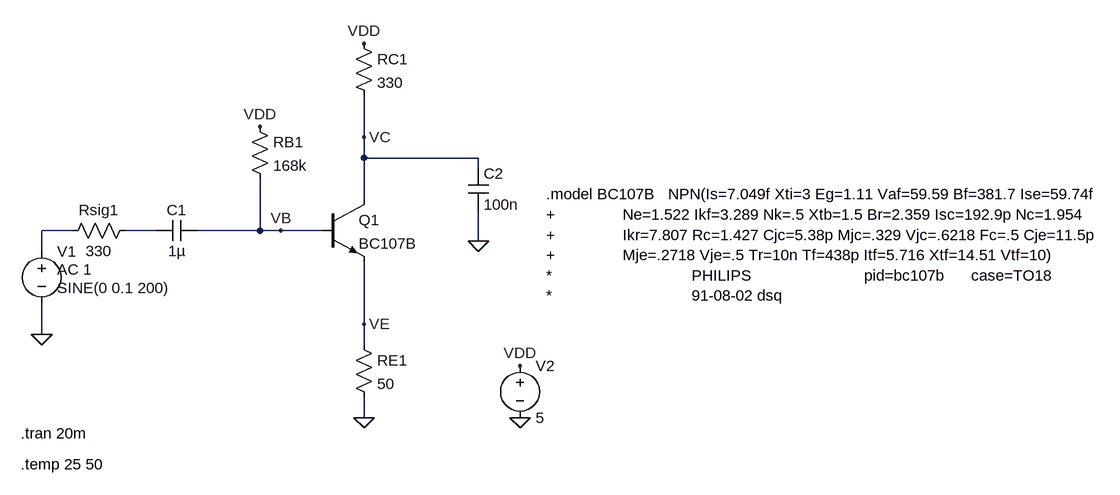
[diagram p0: schematic température.asc]
température.asc, the LTspice schematic file:
Version 4
SHEET 1 1056 680
WIRE -160 64 -160 0
WIRE -160 96 -160 64
WIRE 16 96 -160 96
WIRE 16 112 16 96
WIRE -160 160 -160 96
WIRE -608 208 -656 208
WIRE -480 208 -528 208
WIRE -320 208 -320 128
WIRE -320 208 -416 208
WIRE -288 208 -320 208
WIRE -224 208 -288 208
WIRE 16 224 16 176
WIRE -656 240 -656 208
WIRE -160 352 -160 256
WIRE -656 368 -656 320
WIRE -160 384 -160 352
WIRE -160 496 -160 464
FLAG -656 368 0
FLAG -160 496 0
FLAG 16 224 0
FLAG 80 496 0
FLAG 80 416 VDD
FLAG -160 -80 VDD
FLAG -320 48 VDD
FLAG -288 208 VB
FLAG -160 352 VE
FLAG -160 64 VC
SYMBOL npn -224 160 R0
SYMATTR InstName Q1
SYMATTR Value BC107B
SYMBOL cap -416 192 R90
WINDOW 0 0 32 VBottom 2
WINDOW 3 32 32 VTop 2
SYMATTR InstName C1
SYMATTR Value 1µ
SYMBOL res -512 192 R90
WINDOW 0 0 56 VBottom 2
WINDOW 3 32 56 VTop 2
SYMATTR InstName Rsig1
SYMATTR Value 330
SYMBOL res -336 32 R0
SYMATTR InstName RB1
SYMATTR Value 168k
SYMBOL res -176 -96 R0
SYMATTR InstName RC1
SYMATTR Value 330
SYMBOL res -176 368 R0
SYMATTR InstName RE1
SYMATTR Value 50
SYMBOL cap 0 112 R0
SYMATTR InstName C2
SYMATTR Value 100n
SYMBOL voltage -656 224 R0
WINDOW 123 24 44 Left 2
WINDOW 39 0 0 Left 0
WINDOW 3 24 72 Left 2
SYMATTR Value2 AC 1
SYMATTR InstName V1
SYMATTR Value SINE(0 0.1 200)
SYMBOL voltage 80 400 R0
WINDOW 123 0 0 Left 0
WINDOW 39 0 0 Left 0
SYMATTR InstName V2
SYMATTR Value 5
TEXT 120 152 Left 2 !.model BC107B   NPN(Is=7.049f Xti=3 Eg=1.11 Vaf=59.59 Bf=381.7 Ise=59.74f\n+               Ne=1.522 Ikf=3.289 Nk=.5 Xtb=1.5 Br=2.359 Isc=192.9p Nc=1.954\n+               Ikr=7.807 Rc=1.427 Cjc=5.38p Mjc=.329 Vjc=.6218 Fc=.5 Cje=11.5p\n+               Mje=.2718 Vje=.5 Tr=10n Tf=438p Itf=5.716 Xtf=14.51 Vtf=10)\n*                               PHILIPS                         pid=bc107b      case=TO18\n*                               91-08-02 dsq
TEXT -688 520 Left 2 !.tran 20m
TEXT -688 568 Left 2 !.temp 25 50

The netlist it stands for:
* température.asc
Q1 VC VB VE 0 BC107B
C1 VB N002 1µ
Rsig1 N002 N001 330
RB1 VDD VB 168k
RC1 VDD VC 330
RE1 VE 0 50
C2 VC 0 100n
V1 N001 0 SINE(0 0.1 200) AC 1
V2 VDD 0 5
.model NPN NPN
.model PNP PNP
.lib standard.bjt
.model BC107B   NPN(Is=7.049f Xti=3 Eg=1.11 Vaf=59.59 Bf=381.7 Ise=59.74f
+               Ne=1.522 Ikf=3.289 Nk=.5 Xtb=1.5 Br=2.359 Isc=192.9p Nc=1.954
+               Ikr=7.807 Rc=1.427 Cjc=5.38p Mjc=.329 Vjc=.6218 Fc=.5 Cje=11.5p
+               Mje=.2718 Vje=.5 Tr=10n Tf=438p Itf=5.716 Xtf=14.51 Vtf=10)
*                               PHILIPS                         pid=bc107b      case=TO18
*                               91-08-02 dsq
.tran 20m
.temp 25 50
.backanno
.end

* Results of the author's LTspice run, read from the files saved beside the schematic
* Operating Point (first step), zero values left out:
*   temperature = 25 
*   V(vc) = 2.614 V
*   V(vb) = 1.081 V
*   V(ve) = 362.7 mV
*   V(vdd) = 5 V
*   Ic(Q1) = 7.231 mA
*   Ib(Q1) = 23.33 µA
*   Ie(Q1) = -7.255 mA
*   I(Re1) = 7.255 mA
*   I(Rc1) = 7.231 mA
*   I(Rb1) = 23.33 µA
*   I(V2) = -7.255 mA
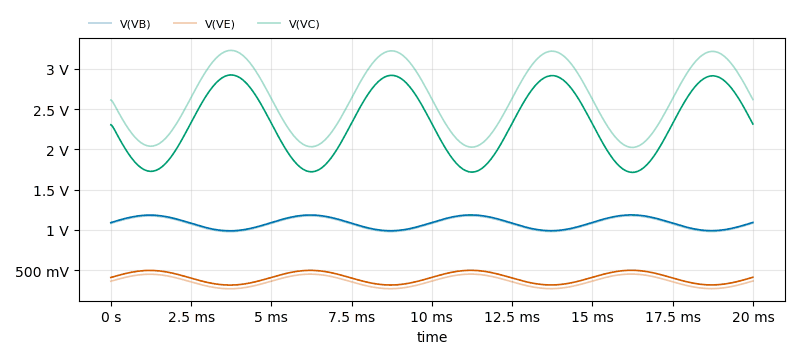
[diagram p1: Transient Analysis of température.asc, plotted from the saved traces]
* Transient Analysis, 2 runs:
*   V(VB) [temp=25°C]: min 978.9 mV, max 1.176 V, average 1.078 V, rms 1.08 V, last 1.084 V
*   V(VB) [temp=50°C]: min 989.4 mV, max 1.187 V, average 1.088 V, rms 1.09 V, last 1.094 V
*   V(VE) [temp=25°C]: min 269 mV, max 452.3 mV, average 360.3 mV, rms 365.9 mV, last 365.6 mV
*   V(VE) [temp=50°C]: min 315.2 mV, max 499.2 mV, average 406.9 mV, rms 412 mV, last 411.7 mV
*   V(VC) [temp=25°C]: min 2.025 V, max 3.23 V, average 2.63 V, rms 2.663 V, last 2.62 V
*   V(VC) [temp=50°C]: min 1.715 V, max 2.925 V, average 2.322 V, rms 2.361 V, last 2.315 V